# Altium schematic sheet Resistor - 825-988.SchDoc
size A0; SheetNumber: 13; SheetTotal: 14
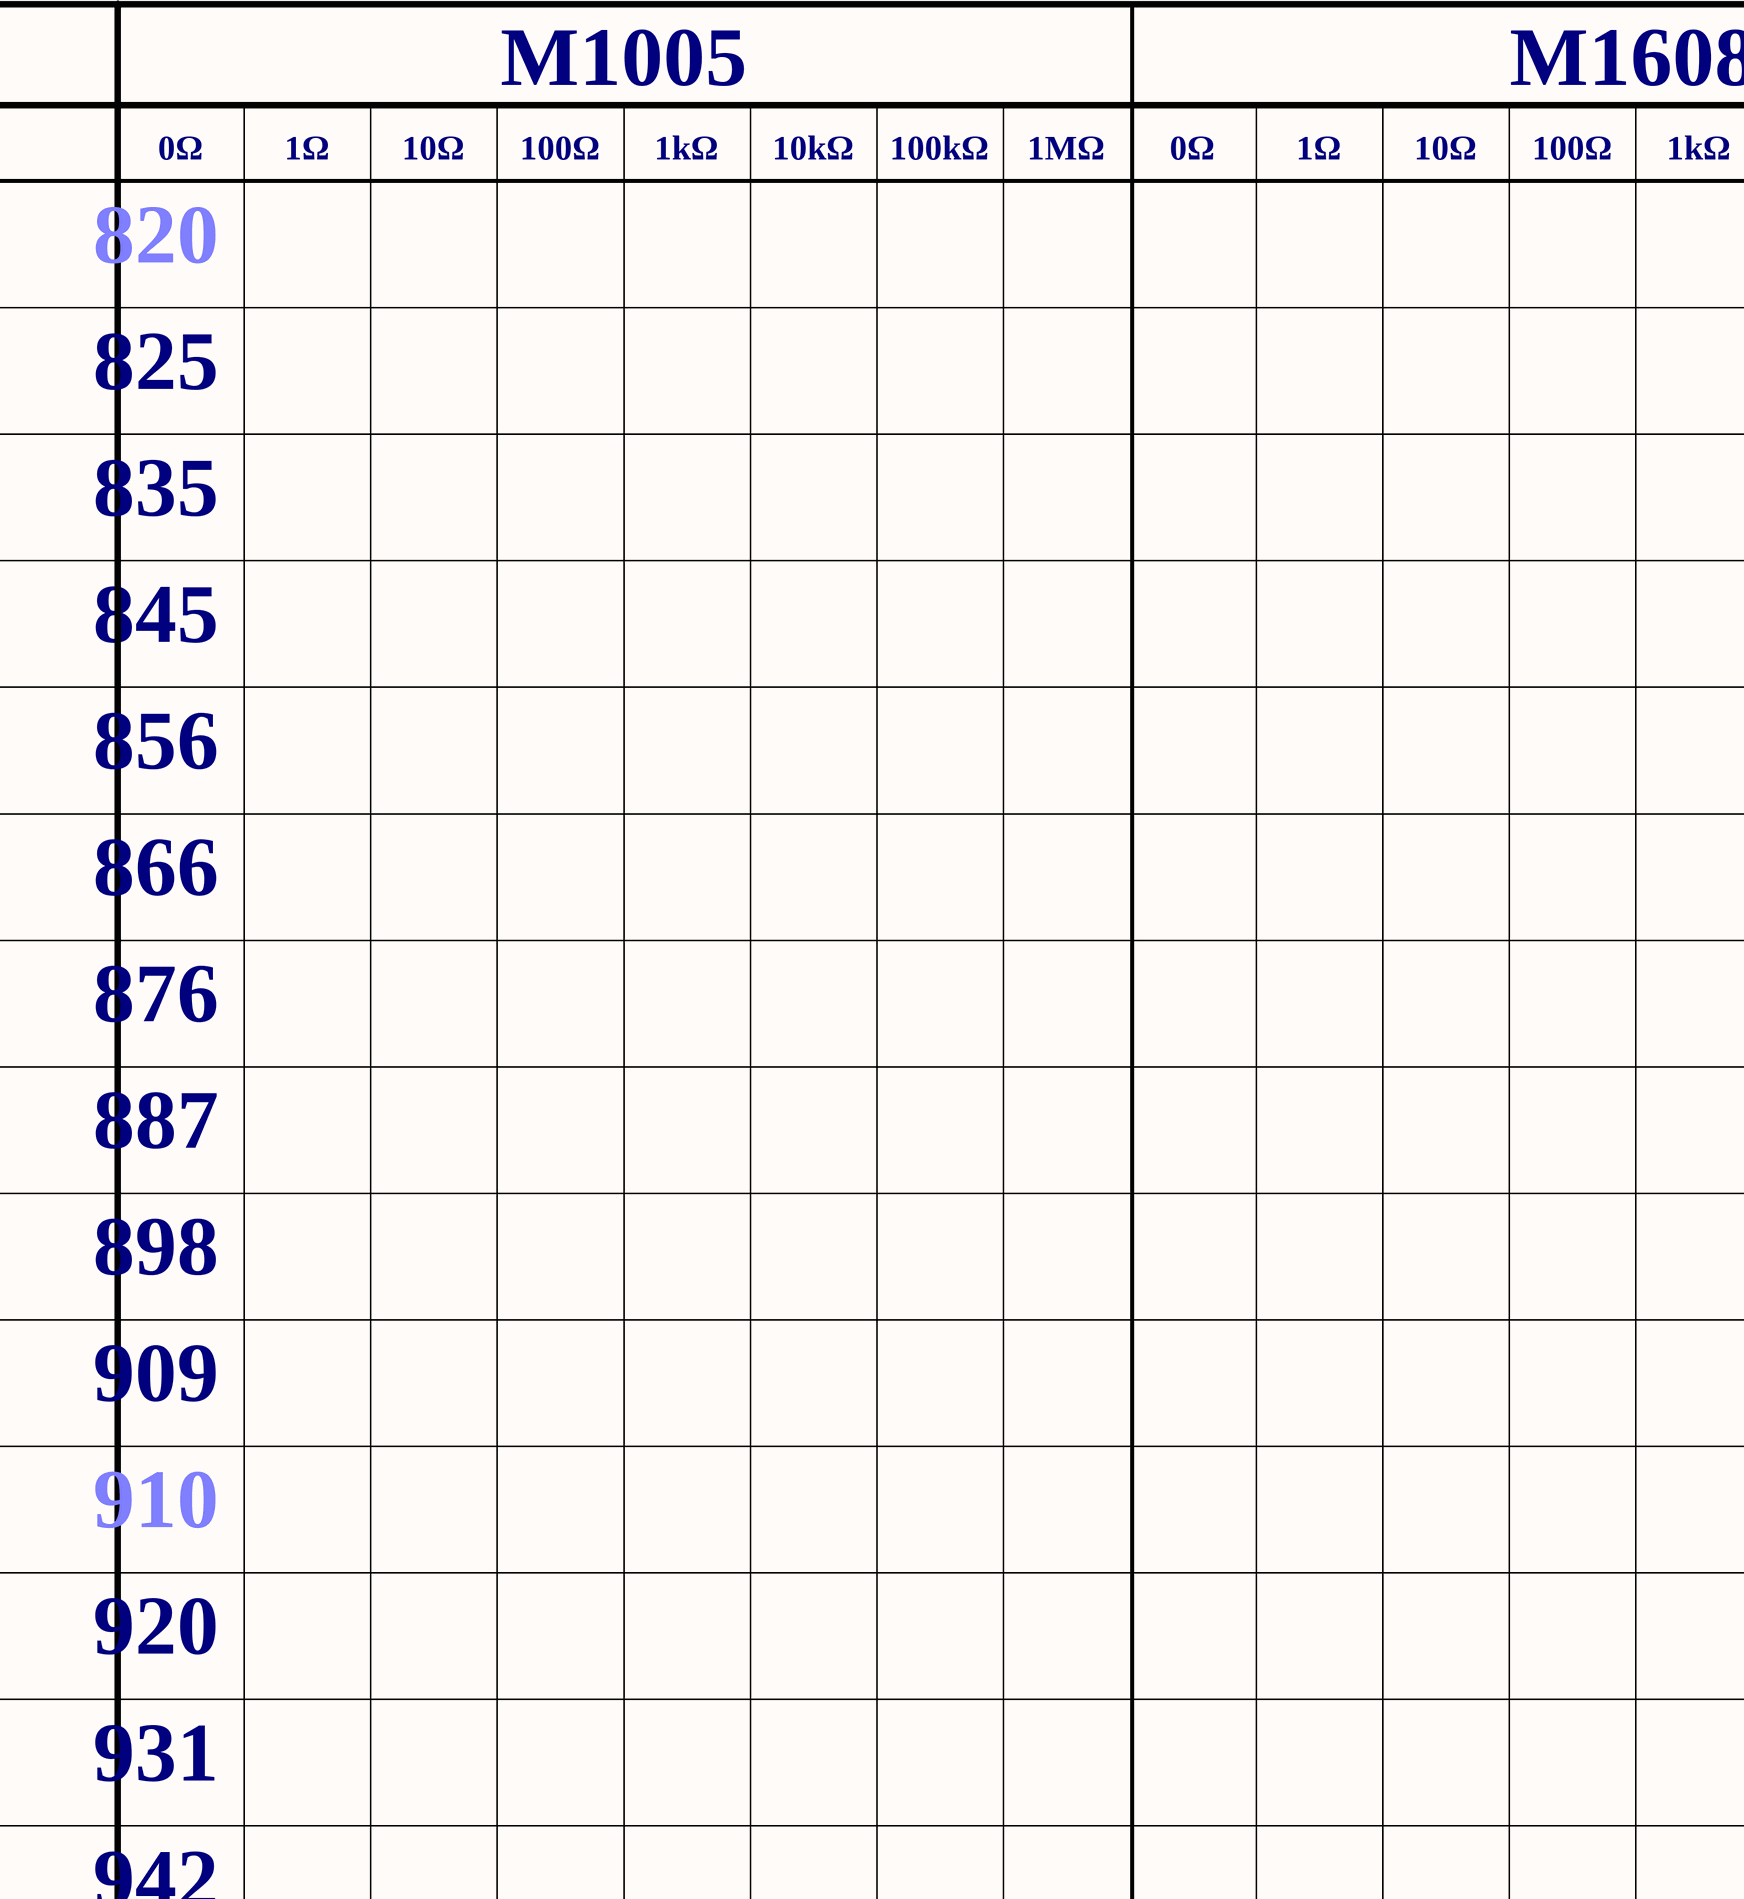
[diagram p0: Resistor - 825-988.SchDoc, top left]
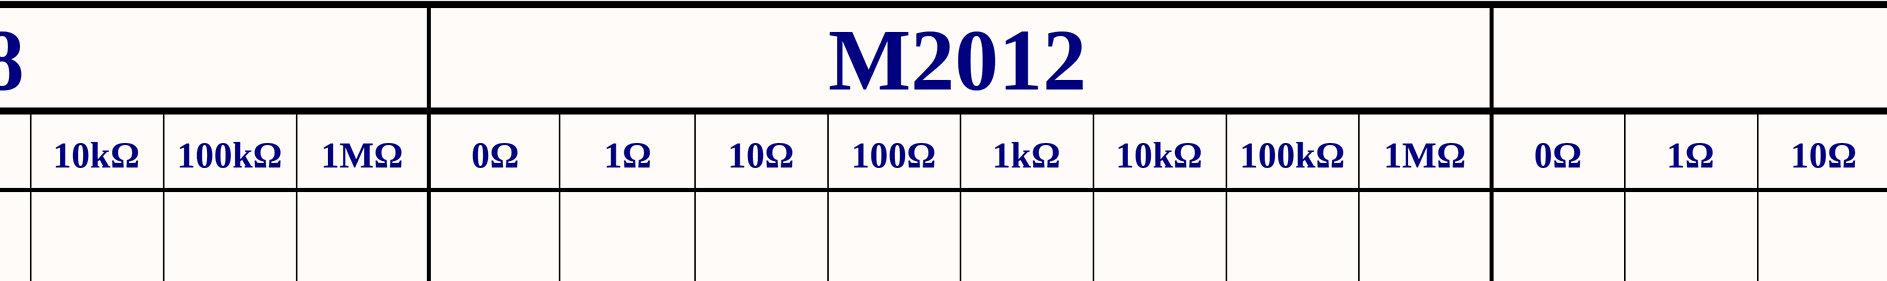
[diagram p1: Resistor - 825-988.SchDoc, top middle]
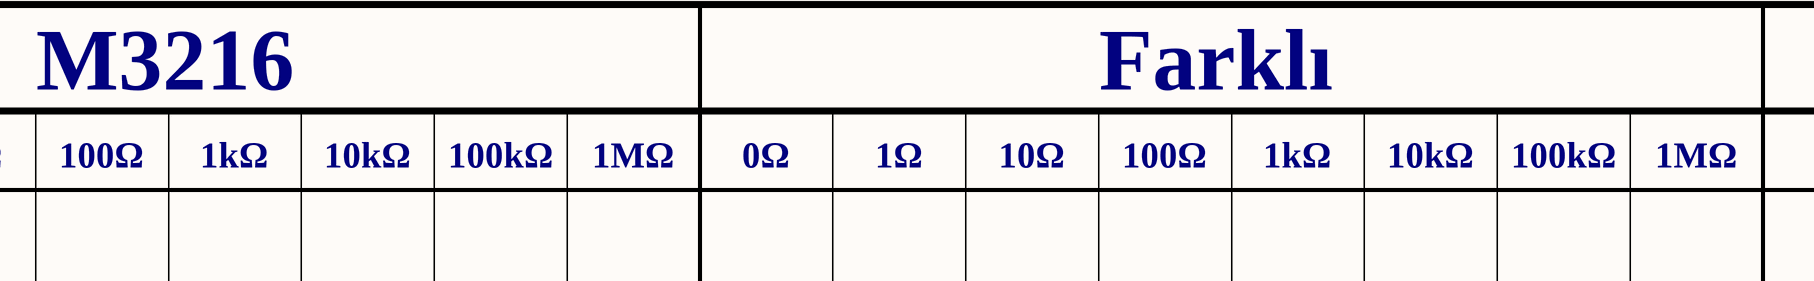
[diagram p2: Resistor - 825-988.SchDoc, top right]
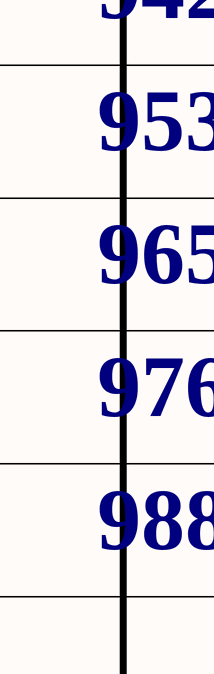
[diagram p3: Resistor - 825-988.SchDoc, bottom left]

## Notes on the sheet
- M1005
- M1608
- M2012
- M3216
- Farklı
- 0Ω
- 1Ω
- 10Ω
- 100Ω
- 1kΩ
- 10kΩ
- 100kΩ
- 1MΩ
- 820
- 825
- 835
- 845
- 856
- 866
- 876
- 887
- 898
- 909
- 910
- 920
- 931
- 942
- 953
- 965
- 976
- 988